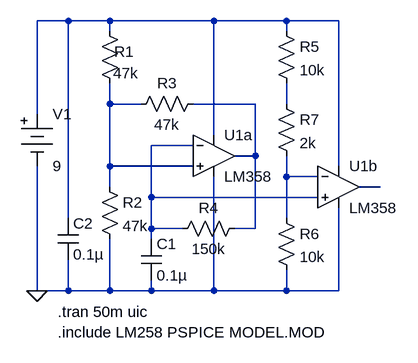
[diagram p0: schematic LM358 oscillator PWM.asc]
LM358 oscillator PWM.asc, the LTspice schematic file:
Version 4
SHEET 1 2036 928
WIRE 336 256 288 256
WIRE 400 256 336 256
WIRE 560 256 400 256
WIRE 672 256 560 256
WIRE 752 256 672 256
WIRE 400 272 400 256
WIRE 672 272 672 256
WIRE 400 384 400 352
WIRE 448 384 400 384
WIRE 624 384 528 384
WIRE 672 384 672 352
WIRE 288 400 288 256
WIRE 560 432 560 256
WIRE 528 448 464 448
WIRE 624 464 624 384
WIRE 624 464 592 464
WIRE 400 480 400 384
WIRE 528 480 400 480
WIRE 752 480 752 256
WIRE 672 496 672 464
WIRE 720 496 672 496
WIRE 400 512 400 480
WIRE 816 512 784 512
WIRE 464 528 464 448
WIRE 720 528 464 528
WIRE 336 560 336 256
WIRE 672 560 672 496
WIRE 464 576 464 528
WIRE 512 576 464 576
WIRE 624 576 624 464
WIRE 624 576 592 576
WIRE 464 592 464 576
WIRE 288 672 288 480
WIRE 336 672 336 624
WIRE 336 672 288 672
WIRE 400 672 400 592
WIRE 400 672 336 672
WIRE 464 672 464 656
WIRE 464 672 400 672
WIRE 560 672 560 496
WIRE 560 672 464 672
WIRE 672 672 672 640
WIRE 672 672 560 672
WIRE 752 672 752 544
WIRE 752 672 672 672
FLAG 288 672 0
SYMBOL battery 288 384 R0
SYMATTR InstName V1
SYMATTR Value 9
SYMBOL res 384 256 R0
WINDOW 0 23 48 Left 2
WINDOW 3 21 81 Left 2
SYMATTR InstName R1
SYMATTR Value 47k
SYMBOL res 384 496 R0
SYMATTR InstName R2
SYMATTR Value 47k
SYMBOL res 608 560 R90
WINDOW 0 0 56 VBottom 2
WINDOW 3 32 56 VTop 2
SYMATTR InstName R4
SYMATTR Value 150k
SYMBOL cap 448 592 R0
SYMATTR InstName C1
SYMATTR Value 0.1µ
SYMBOL res 544 368 R90
WINDOW 0 0 56 VBottom 2
WINDOW 3 32 56 VTop 2
SYMATTR InstName R3
SYMATTR Value 47k
SYMBOL res 656 256 R0
SYMATTR InstName R5
SYMATTR Value 10k
SYMBOL res 656 544 R0
SYMATTR InstName R6
SYMATTR Value 10k
SYMBOL res 656 368 R0
SYMATTR InstName R7
SYMATTR Value 2k
SYMBOL cap 320 560 R0
SYMATTR InstName C2
SYMATTR Value 0.1µ
SYMBOL opamp2 560 400 R0
SYMATTR InstName U1a
SYMATTR Value LM358
SYMATTR SpiceModel LM358
SYMBOL opamp2 752 448 R0
SYMATTR InstName U1b
SYMATTR Value LM358
TEXT 320 704 Left 2 !.tran 50m uic
TEXT 320 736 Left 2 !.include LM258 PSPICE MODEL.MOD

The netlist it stands for:
* LM358 oscillator PWM.asc
V1 N001 0 9
R1 N001 N002 47k
R2 N002 0 47k
R4 N003 N005 150k
C1 N005 0 0.1µ
R3 N003 N002 47k
R5 N001 N004 10k
R6 N006 0 10k
R7 N004 N006 2k
C2 N001 0 0.1µ
XU1a N002 N005 N001 0 N003 LM358 LM358  ; pins In+ In- V+ V- OUT
XU1b N005 N006 N001 0 N007 LM358  ; pins In+ In- V+ V- OUT
.tran 50m uic
.include LM258 PSPICE MODEL.MOD
.backanno
.end